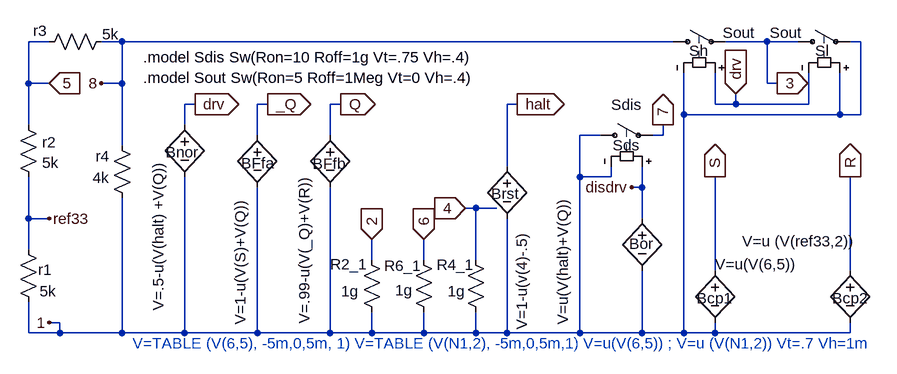
[diagram p0: schematic Lt555_Beh.asc]
Lt555_Beh.asc, the LTspice schematic file:
Version 4
SHEET 1 1152 916
WIRE -576 240 -576 176
WIRE -576 304 -576 240
WIRE -576 448 -576 384
WIRE -576 496 -576 448
WIRE -576 624 -576 576
WIRE -544 176 -576 176
WIRE -544 240 -576 240
WIRE -544 448 -576 448
WIRE -528 608 -544 608
WIRE -528 624 -576 624
WIRE -528 624 -528 608
WIRE -432 176 -464 176
WIRE -432 240 -464 240
WIRE -432 240 -432 176
WIRE -432 336 -432 240
WIRE -432 624 -528 624
WIRE -432 624 -432 416
WIRE -336 304 -336 272
WIRE -336 624 -432 624
WIRE -336 624 -336 384
WIRE -320 272 -336 272
WIRE -224 320 -224 272
WIRE -224 624 -336 624
WIRE -224 624 -224 400
WIRE -208 272 -224 272
WIRE -112 320 -112 272
WIRE -112 624 -224 624
WIRE -112 624 -112 400
WIRE -96 272 -112 272
WIRE -48 512 -48 480
WIRE -48 624 -112 624
WIRE -48 624 -48 592
WIRE 32 512 32 480
WIRE 32 624 -48 624
WIRE 32 624 32 592
WIRE 112 432 96 432
WIRE 112 512 112 432
WIRE 112 624 32 624
WIRE 112 624 112 592
WIRE 144 432 112 432
WIRE 160 368 160 272
WIRE 160 624 112 624
WIRE 160 624 160 448
WIRE 176 272 160 272
WIRE 272 384 272 320
WIRE 272 624 160 624
WIRE 272 624 272 384
WIRE 304 320 272 320
WIRE 320 384 272 384
WIRE 320 384 320 368
WIRE 368 400 352 400
WIRE 368 400 368 368
WIRE 368 448 368 400
WIRE 368 624 272 624
WIRE 368 624 368 528
WIRE 400 320 384 320
WIRE 400 320 400 304
WIRE 416 176 -432 176
WIRE 432 288 432 224
WIRE 432 624 368 624
WIRE 432 624 432 288
WIRE 480 272 480 224
WIRE 480 528 480 384
WIRE 480 624 432 624
WIRE 480 624 480 608
WIRE 512 272 480 272
WIRE 512 272 512 256
WIRE 560 176 496 176
WIRE 560 240 560 176
WIRE 576 240 560 240
WIRE 608 176 560 176
WIRE 624 272 512 272
WIRE 624 272 624 224
WIRE 672 288 432 288
WIRE 672 288 672 224
WIRE 688 528 688 384
WIRE 688 624 480 624
WIRE 688 624 688 608
WIRE 704 176 688 176
WIRE 704 288 672 288
WIRE 704 288 704 176
FLAG -544 448 ref33
FLAG -544 240 5
IOPIN -544 240 In
FLAG 400 304 7
IOPIN 400 304 Out
FLAG 352 400 disdrv
FLAG -464 240 8
FLAG 576 240 3
IOPIN 576 240 Out
FLAG 512 256 drv
IOPIN 512 256 In
FLAG -544 608 1
FLAG 96 432 4
IOPIN 96 432 In
FLAG 32 480 6
IOPIN 32 480 In
FLAG 480 384 S
IOPIN 480 384 Out
FLAG -48 480 2
IOPIN -48 480 In
FLAG 688 384 R
IOPIN 688 384 Out
FLAG -320 272 drv
IOPIN -320 272 Out
FLAG -208 272 _Q
IOPIN -208 272 Out
FLAG -96 272 Q
IOPIN -96 272 Out
FLAG 176 272 halt
IOPIN 176 272 Out
SYMBOL res -592 480 R0
WINDOW 0 31 47 Left 0
WINDOW 3 33 80 Left 0
SYMATTR InstName r1
SYMATTR Value 5k
SYMBOL res -592 288 R0
WINDOW 0 37 43 Left 0
WINDOW 3 37 74 Left 0
SYMATTR InstName r2
SYMATTR Value 5k
SYMBOL res -448 160 R90
WINDOW 0 15 110 VBottom 0
WINDOW 3 -11 2 VTop 0
SYMATTR InstName r3
SYMATTR Value 5k
SYMBOL sw 288 320 R270
WINDOW 0 -15 35 VRight 0
WINDOW 3 47 32 VRight 0
SYMATTR InstName Sds
SYMATTR Value Sdis
SYMBOL sw 400 176 R270
WINDOW 0 -14 40 VRight 0
WINDOW 3 14 92 VRight 0
SYMATTR InstName Sh
SYMATTR Value Sout
SYMBOL sw 592 176 R270
WINDOW 0 -14 42 VRight 0
WINDOW 3 14 -28 VRight 0
SYMATTR InstName Sl
SYMATTR Value Sout
SYMBOL res -448 320 R0
WINDOW 0 -25 32 Left 0
WINDOW 3 -29 65 Left 0
SYMATTR InstName r4
SYMATTR Value 4k
SYMBOL res -32 608 R180
WINDOW 0 22 90 Left 0
WINDOW 3 36 48 Left 0
SYMATTR InstName R2_1
SYMATTR Value 1g
SYMBOL bv 480 512 R0
WINDOW 0 -28 59 Left 0
WINDOW 3 126 6 Right 0
SYMATTR InstName Bcp1
SYMATTR Value V=u(V(6,5))
SYMBOL bv 688 512 R0
WINDOW 0 -28 59 Left 0
WINDOW 3 -166 -29 Left 0
SYMATTR InstName Bcp2
SYMATTR Value V=u (V(ref33,2))
SYMBOL bv 368 432 R0
WINDOW 0 -20 55 Left 0
WINDOW 3 -122 -17 VRight 0
SYMATTR InstName Bor
SYMATTR Value V=u(V(halt)+V(Q))
SYMBOL bv -336 288 R0
WINDOW 0 -29 58 Left 0
WINDOW 3 -40 70 VRight 0
SYMATTR InstName Bnor
SYMATTR Value V=.5-u(V(halt) +V(Q))
SYMBOL bv -224 304 R0
WINDOW 0 -25 59 Left 0
WINDOW 3 -26 113 VRight 0
SYMATTR InstName BFfa
SYMATTR Value V=1-u(V(S)+V(Q))
SYMBOL bv -112 304 R0
WINDOW 0 -27 60 Left 0
WINDOW 3 -40 76 VRight 0
SYMATTR InstName BFfb
SYMATTR Value V=.99-u(V(_Q)+V(R))
SYMBOL bv 160 352 R0
WINDOW 0 -24 58 Left 0
WINDOW 3 23 268 VLeft 0
SYMATTR InstName Brst
SYMATTR Value V=1-u(v(4)-.5)
SYMBOL res 16 496 R0
WINDOW 0 13 25 Right 0
WINDOW 3 -28 62 Left 0
SYMATTR InstName R6_1
SYMATTR Value 1g
SYMBOL res 96 496 R0
WINDOW 0 -44 23 Left 0
WINDOW 3 -27 64 Left 0
SYMATTR InstName R4_1
SYMATTR Value 1g
TEXT -400 200 Left 0 !.model Sdis Sw(Ron=10 Roff=1g Vt=.75 Vh=.4)\n.model Sout Sw(Ron=5 Roff=1Meg Vt=0 Vh=.4)
TEXT -416 640 Left 0 ;V=TABLE (V(6,5), -5m,0,5m, 1) V=TABLE (V(N1,2), -5m,0,5m,1) V=u(V(6,5)) ; V=u (V(N1,2)) Vt=.7 Vh=1m

The netlist it stands for:
* Lt555_Beh.asc
r1 ref33 1 5k
r2 5 ref33 5k
r3 8 5 5k
Sds 1 7 disdrv 1 Sdis
Sh 8 3 drv 1 Sout
Sl 3 1 1 drv Sout
r4 8 1 4k
R2_1 1 2 1g
Bcp1 S 1 V=u(V(6,5))
Bcp2 R 1 V=u (V(ref33,2))
Bor disdrv 1 V=u(V(halt)+V(Q))
Bnor drv 1 V=.5-u(V(halt) +V(Q))
BFfa _Q 1 V=1-u(V(S)+V(Q))
BFfb Q 1 V=.99-u(V(_Q)+V(R))
Brst halt 1 V=1-u(v(4)-.5)
R6_1 6 1 1g
R4_1 4 1 1g
.model Sdis Sw(Ron=10 Roff=1g Vt=.75 Vh=.4)
.model Sout Sw(Ron=5 Roff=1Meg Vt=0 Vh=.4)
* V=TABLE (V(6,5), -5m,0,5m, 1) V=TABLE (V(N1,2), -5m,0,5m,1) V=u(V(6,5)) ; V=u (V(N1,2)) Vt=.7 Vh=1m
.backanno
.end